# EAGLE schematic cloudv7 (EAGLE 8.2.2)
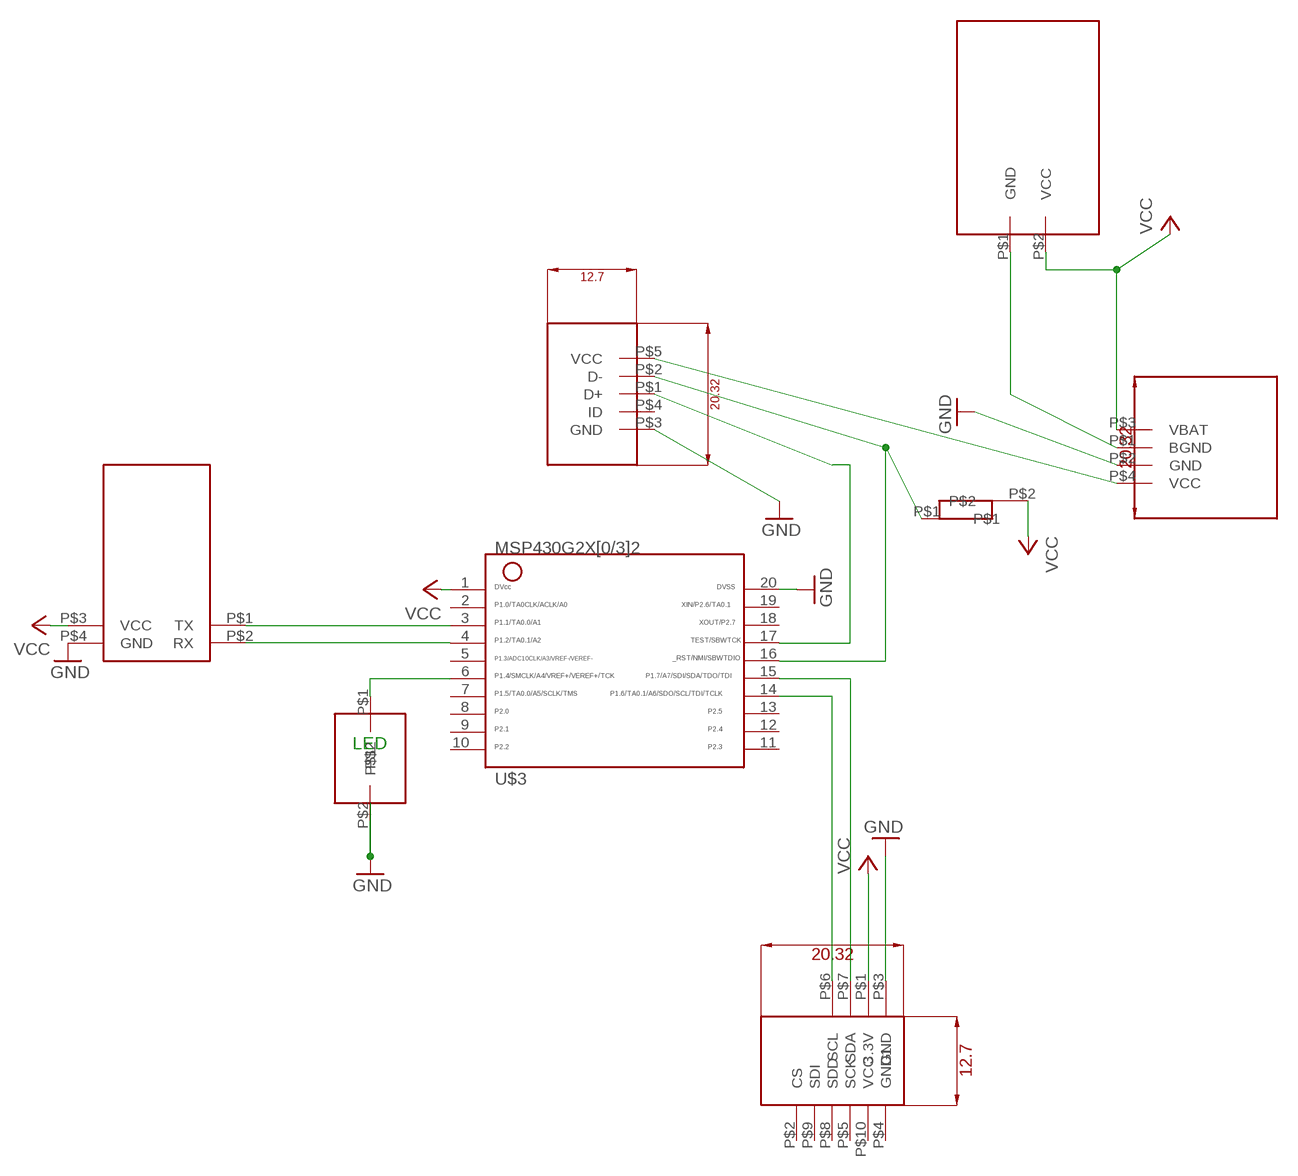
[diagram p0: schematic, sheet 1]

## Parts
U$1  USBUSB  [USB]
U$2  CHARGECHARGE  [CHARGE]
U$3  MSP430G553MSP430G2553  [MSP430G553]
U$4  BATTERYBATTERY  [BATTERY]
U$5  1KOHM1KOHM  [1KOHM]
U$6  BM240BM240  [BM240]
U$7  RN41RN41  [RN41]
U$8  LEDLED  [LED]

## Nets
GND: U$1.P$3(GND) U$2.P$2(GND) U$3.20 U$6.P$3(GND) U$8.P$2
N$1: U$3.3 U$7.P$1(TX)
N$2: U$1.P$2(D-) U$3.16 U$5.P$1
N$3: U$3.15 U$6.P$7(SDA)
N$4: U$3.14 U$6.P$6(SCL)
N$5: U$3.4 U$7.P$2(RX)
N$7: U$1.P$5(VCC) U$2.P$4(VCC)
N$8: U$1.P$1(D+) U$3.17
N$9: U$2.P$1(BGND) U$4.P$1(GND)
N$10: U$3.6 U$8.P$1
VCC: U$2.P$3(VBAT) U$3.1 U$4.P$2(VCC) U$5.P$2 U$6.P$1(3.3V) U$7.P$3(VCC)
Unconnected: U$1.P$4(ID) U$3.2 U$3.5 U$3.7 U$3.8 U$3.9 U$3.10 U$3.11 U$3.12 U$3.13 U$3.18 U$3.19 U$6.P$2(CS) U$6.P$4(GND1) U$6.P$5(SCK) U$6.P$8(SDD) U$6.P$9(SDI) U$6.P$10(VCC) U$7.P$4(GND)

## Notes on the sheet
- LED

## Library data of the parts
U$1 = clouddemo:USB; HEIGHT: 15.00
U$2 = clouddemo:CHARGE; HEIGHT: 15.00
U$3 = clouddemo:MSP430G553; HEIGHT: 20
U$4 = clouddemo:BATTERY; HEIGHT: 10
U$5 = clouddemo:1KOHM; HEIGTH: 10
U$6 = clouddemo:BM240; HEIGHT: 15.0
U$7 = clouddemo:RN41; HEIGHT: 0.7
U$8 = clouddemo:LED; HEIGHT: 10.0